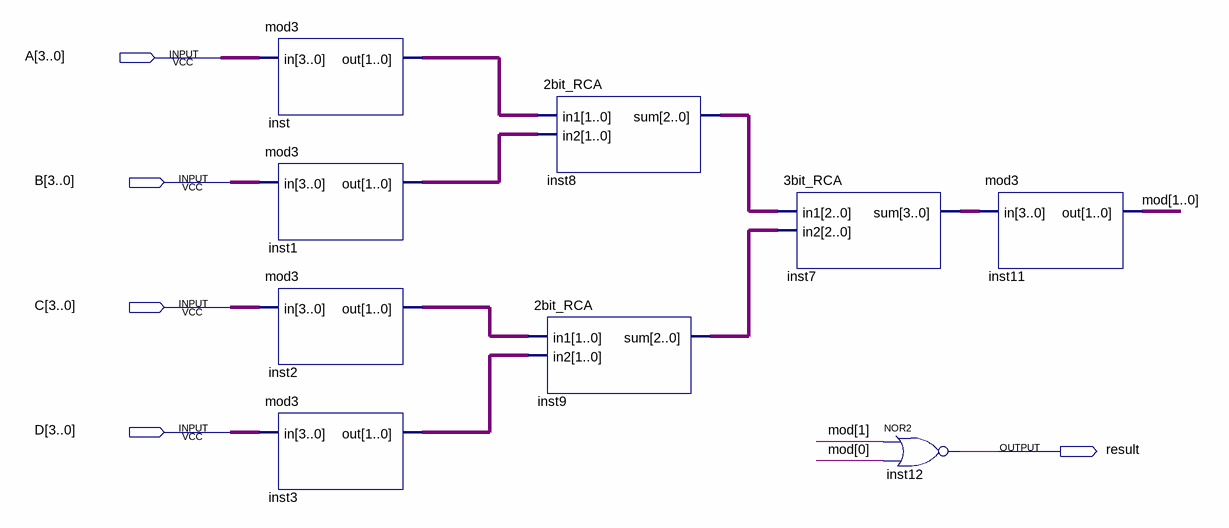
[diagram p0: schematic sheet]
// Quartus schematic P1_mod3.bdf as structural Verilog: 9 symbols, 5 pins
module P1_mod3 (
  input  [3:0] A,
  input  [3:0] B,
  input  [3:0] C,
  input  [3:0] D,
  output result
);

  wire [1:0] inst1_out, inst2_out, inst3_out, inst_out, mod;
  wire [2:0] inst8_sum, inst9_sum;
  wire [3:0] inst7_sum;

  mod3 inst (.in(A), .out(inst_out));
  mod3 inst1 (.in(B), .out(inst1_out));
  mod3 inst2 (.in(C), .out(inst2_out));
  mod3 inst3 (.in(D), .out(inst3_out));
  \2bit_RCA  inst8 (.in1(inst_out), .in2(inst1_out), .sum(inst8_sum));
  \2bit_RCA  inst9 (.in1(inst2_out), .in2(inst3_out), .sum(inst9_sum));
  \3bit_RCA  inst7 (.in1(inst8_sum), .in2(inst9_sum), .sum(inst7_sum));
  nor inst12 (result, mod[1], mod[0]);
  mod3 inst11 (.in(inst7_sum), .out(mod));
endmodule
